# EAGLE design 3310 (EAGLE 7.1.0)
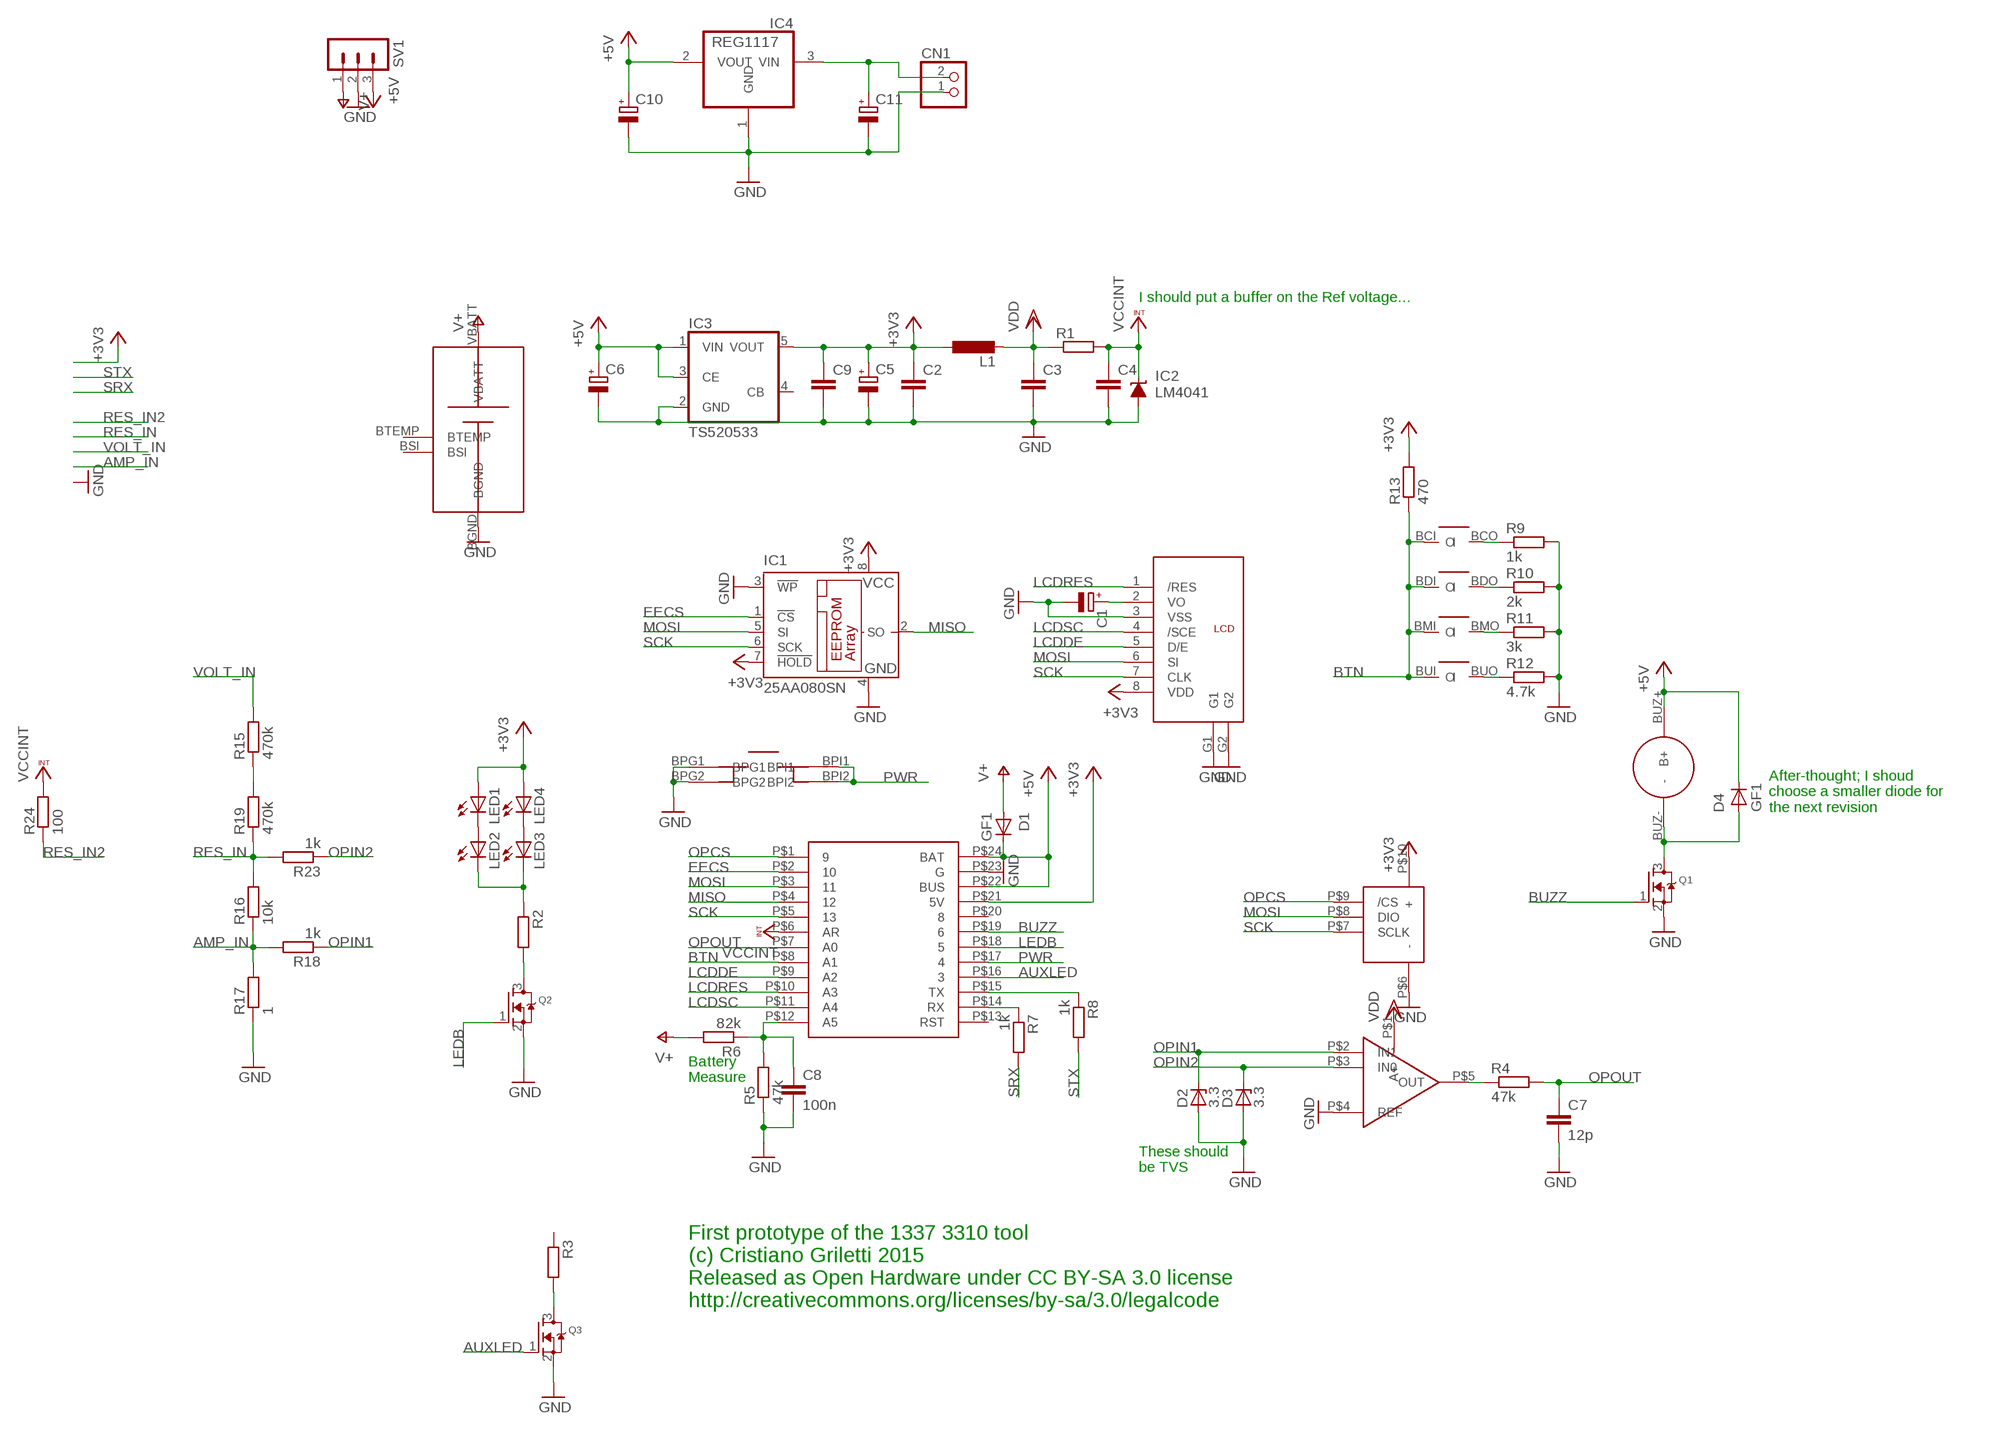
[diagram p0: schematic, sheet 1]

## Parts
C1  CPOL-EUC/6032-28R  [C/6032-28R]
C2  C-EUC0805K  [C0805K]
C3  C-EUC0805K  [C0805K]
C4  C-EUC0805K  [C0805K]
C5  CPOL-EUB/3528-21R  [B/3528-21R]
C6  CPOL-EUB/3528-21R  [B/3528-21R]
C7  12p  C-EUC0805K  [C0805K]
C8  100n  C-EUC0805K  [C0805K]
C9  C-EUC0805K  [C0805K]
C10  CPOL-EUB/3528-21R  [B/3528-21R]
C11  CPOL-EUB/3528-21R  [B/3528-21R]
CN1  JST_2PIN-SMT  [JST-PH-2-SMT]
D1  GF1  [SMA-DO214AC]
D2  3.3  ZENER-DIODESOD80C  [SOD80C]
D3  3.3  ZENER-DIODESOD80C  [SOD80C]
D4  GF1  [SMA-DO214AC]
IC1  25AA080SN  [SO-08]
IC2  LM4041  LM4041A12DBZ  [DBZ_R-PDSO-G3]
IC3  TS520533  [SOT25]
IC4  REG1117  [SOT223]
L1  L-EUL3216C  [L3216C]
LED1  LEDCHIPLED_0603  [CHIPLED_0603]
LED2  LEDCHIPLED_0603  [CHIPLED_0603]
LED3  LEDCHIPLED_0603  [CHIPLED_0603]
LED4  LEDCHIPLED_0603  [CHIPLED_0603]
Q1  MOSFET-NREFLOW  [SOT23]
Q2  MOSFET-NREFLOW  [SOT23]
Q3  MOSFET-NREFLOW  [SOT23]
R1  R-EU_R0805  [R0805]
R2  R-EU_R0805  [R0805]
R3  R-EU_R0805  [R0805]
R4  47k  R-EU_R0805  [R0805]
R5  47k  R-EU_R0805  [R0805]
R6  82k  R-EU_R0805  [R0805]
R7  1k  R-EU_R0805  [R0805]
R8  1k  R-EU_R0805  [R0805]
R9  1k  R-EU_R0805  [R0805]
R10  2k  R-EU_R0805  [R0805]
R11  3k  R-EU_R0805  [R0805]
R12  4.7k  R-EU_R0805  [R0805]
R13  470  R-EU_R0805  [R0805]
R15  470k  R-EU_R0805  [R0805]
R16  10k  R-EU_R0805  [R0805]
R17  1  R-EU_R0805  [R0805]
R18  1k  R-EU_R0805  [R0805]
R19  470k  R-EU_R0805  [R0805]
R23  1k  R-EU_R0805  [R0805]
R24  100  R-EU_R0805  [R0805]
SV1  MA03-1  [MA03-1]
U$1  3310PANEL_NONUM  [3310BRD_NONUM]
U$2  PGA113  [VSSOP]
U$3  TRINKET  [TRINKET]

## Nets
+3V3: C2.1 C5.+ C9.1 IC1.7(!HOLD) IC1.8(VCC) IC3.5(VOUT) L1.1 LED1.A LED4.A R13.2 U$1.8(VDD) U$2.P$10(+) U$3.P$21(5V)
+5V: C6.+ C10.+ D1.K(C) D4.K(C) IC3.1(VIN) IC3.3(CE) IC4.2(VOUT) SV1.3 U$1.BUZ+(B+) U$3.P$22(BUS) U$3.P$24(BAT)
AMP_IN: R16.1 R17.2 R18.2
AUXLED: Q3.1(G) U$3.P$16
BTN: R13.1 U$1.BCI(I) U$1.BDI(I) U$1.BMI(I) U$1.BUI(I) U$3.P$8(A1)
BUZZ: Q1.1(G) U$3.P$19
EECS: IC1.1(!CS) U$3.P$2
GND: C1.- C2.2 C3.2 C4.2 C5.- C6.- C7.2 C8.2 C9.2 C10.- C11.- CN1.1 D2.A D3.A IC1.3(!WP) IC1.4(GND) IC2.2(A) IC3.2(GND) IC4.1(GND) Q1.2(S) Q2.2(S) Q3.2(S) R5.1 R9.2 R10.2 R11.2 R12.2 R17.1 SV1.2 U$1.3(VSS) U$1.BGND U$1.BPG1 U$1.BPG2 U$1.G1 U$1.G2 U$2.P$4(REF) U$2.P$6(-) U$3.P$23(G)
LCDDE: U$1.5(D/E) U$3.P$9(A2)
LCDRES: U$1.1(/RES) U$3.P$10(A3)
LCDSC: U$1.4(/SCE) U$3.P$11(A4)
LEDB: Q2.1(G) U$3.P$18
MISO: IC1.2(SO) U$3.P$4
MOSI: IC1.5(SI) U$1.6(SI) U$2.P$8(DIO) U$3.P$3
N$1: C1.+ U$1.2(VO)
N$2: R4.1 U$2.P$5(OUT)
N$3: C8.1 R5.2 R6.1 U$3.P$12(A5)
N$4: D4.A Q1.3(D) U$1.BUZ-(-)
N$5: R8.1 U$3.P$15(TX)
N$6: R7.1 U$3.P$14(RX)
N$7: Q2.3(D) R2.2
N$8: R9.1 U$1.BCO(O)
N$9: R10.1 U$1.BDO(O)
N$10: R11.1 U$1.BMO(O)
N$11: R12.1 U$1.BUO(O)
N$12: R15.1 R19.2
N$13: LED1.C LED2.A
N$14: LED3.A LED4.C
N$17: LED2.C LED3.C R2.1
N$19: Q3.3(D) R3.2
N$21: C11.+ CN1.2 IC4.3(VIN)
OPCS: U$2.P$9(/CS) U$3.P$1
OPIN1: D2.C R18.1 U$2.P$2(IN1)
OPIN2: D3.C R23.1 U$2.P$3(IN0)
OPOUT: C7.1 R4.2 U$3.P$7(A0)
PWR: U$1.BPI1 U$1.BPI2 U$3.P$17
RES_IN: R16.2 R19.1 R23.2
RES_IN2: R24.1
SCK: IC1.6(SCK) U$1.7(CLK) U$2.P$7(SCLK) U$3.P$5
SRX: R7.2
STX: R8.2
V+: D1.A R6.2 SV1.1 U$1.VBATT
VCCINT: C4.1 IC2.1(C) R1.2 R24.2 U$3.P$6(AR)
VDD: C3.1 L1.2 R1.1 U$2.P$1(A+)
VOLT_IN: R15.2
Unconnected: IC3.4(CB) R3.1 U$1.BSI U$1.BTEMP U$3.P$13(RST) U$3.P$20

## Notes on the sheet
- I should put a buffer on the Ref voltage...
- After-thought; I shoud
  choose a smaller diode for
  the next revision
- Battery
  Measure
- These should
  be TVS
- First prototype of the 1337 3310 tool
  (c) Cristiano Griletti 2015
  Released as Open Hardware under CC BY-SA 3.0 license
  http://creativecommons.org/licenses/by-sa/3.0/legalcode

## Library data of the parts
C1 C5 C6 C10 C11 = rcl:CPOL-EU: POLARIZED CAPACITOR, European symbol
C2-C4 C7-C9 = rcl:C-EU: CAPACITOR, European symbol
CN1 = adafruit:JST_2PIN: JST 2-Pin Connectors of various flavors SMT-RA (S2B-PH-SM4) 4UConnector #17311 SMT (B2B-PH-SM4) THM-RA (S2B-PH) THM (B2B-PH)
D1 D4 = diode:GF1: DIODE
D2 D3 = diode:ZENER-DIODE: Z-Diode
IC1 = microchip:25*: Serial EEPROM 4K/ 8K , SPI bus; MF: MICROCHIP; MPN: 25AA080/SN; OC_FARNELL: 1816072; OC_NEWARK: 92C7351
IC2 = texas:LM4041: PRECISION MICROPOWER SHUNT VOLTAGE REFERENCE Source: http://focus.ti.com/lit/ds/slcs146e/slcs146e.pdf; MPN: LM4041A12IDBZR; OC_FARNELL: 1407949; OC_NEWARK: 58K5875
IC3 = v-reg:TS5205: 150mA Low Noise LDO Voltage Regulator with Enable TSC [Taiwan Semiconductor Company, Ltd] Source: http://www.taiwansemi.com .. 5205_0409c.pdf
IC4 = burr-brown:REG1117: 800mA and 1A Low Dropout (LDO) Positive Regulator 1.8V, 2.5V, 2.85V, 3.3V, 5V, and Adj; MPN: REG1117; OC_FARNELL: 1097566; OC_NEWARK: 14P6981
L1 = rcl:L-EU: INDUCTOR, European symbol
LED1-LED4 = adafruit:LED: LED OSRAM: - CHIPLED LG R971, LG N971, LY N971, LG Q971, LY Q971, LO R971, LY R971 LH N974, LH R974 LS Q976, LO Q976, LY Q976 LO Q996 - Hyper CHIPLED LW Q18S LB Q993, LB Q99A, LB R99A - SideLED LS A670, LO A670, LY A670, LG A670, LP A670 LB A673, LV A673, LT A673, LW A673 LH A674 LY A675 LS A676, LA A676, LO A676, LY A676, LW A676 LS A679, LY A679, LG A679 - Hyper Micro SIDELED® LS Y876, LA Y876, LO Y876, LY Y876 LT Y87S - SmartLED LW L88C, LW L88S LB L89C, LB L89S, LG L890 LS L89K, LO L89K, LY L89K LS L896, LA L896, LO L896, LY L896 - TOPLED LS T670, LO T670, LY T670, LG T670, LP T670 LSG T670, LSP T670, LSY T670, LOP T670, LYG T670 LG T671, LOG T671, LSG T671 LB T673, LV T673, LT T673, LW T673 LH T674 LS T676, LA T676, LO T676, LY T676, LB T676, LH T676, LSB T676, LW T676 LB T67C, LV T67C, LT T67C, LS T67K, LO T67K, LY T67K, LW E67C LS E67B, LA E67B, LO E67B, LY E67B, LB E67C, LV E67C, LT E67C LW T67C LS T679, LY T679, LG T679 LS T770, LO T770, LY T770, LG T770, LP T770 LB T773, LV T773, LT T773, LW T773 LH T774 LS E675, LA E675, LY E675, LS T675 LS T776, LA T776, LO T776, LY T776, LB T776 LHGB T686 LT T68C, LB T68C - Hyper Mini TOPLED® LB M676 - Mini TOPLED Santana® LG M470 LS M47K, LO M47K, LY M47K Source: http://www.osram.convergy.de/
Q1-Q3 = adafruit:MOSFET-N: N-Channel Mosfet 2N7002E - 60V 260mA SOT23 [Digikey: 2N7002ET1GOSTR-ND] - REEL BSH103 - 30V 850mA SOT23 [Digikey: 568-5013-1-ND]
R1-R13 R15-R19 R23 R24 = rcl:R-EU_: RESISTOR, European symbol
SV1 = con-lstb:MA03-1: PIN HEADER; OC_FARNELL: unknown; OC_NEWARK: unknown
U$1 = mastrogippo:3310PANEL_NONUM
U$2 = cris2:PGA113
U$3 = cris2:TRINKET

## Board
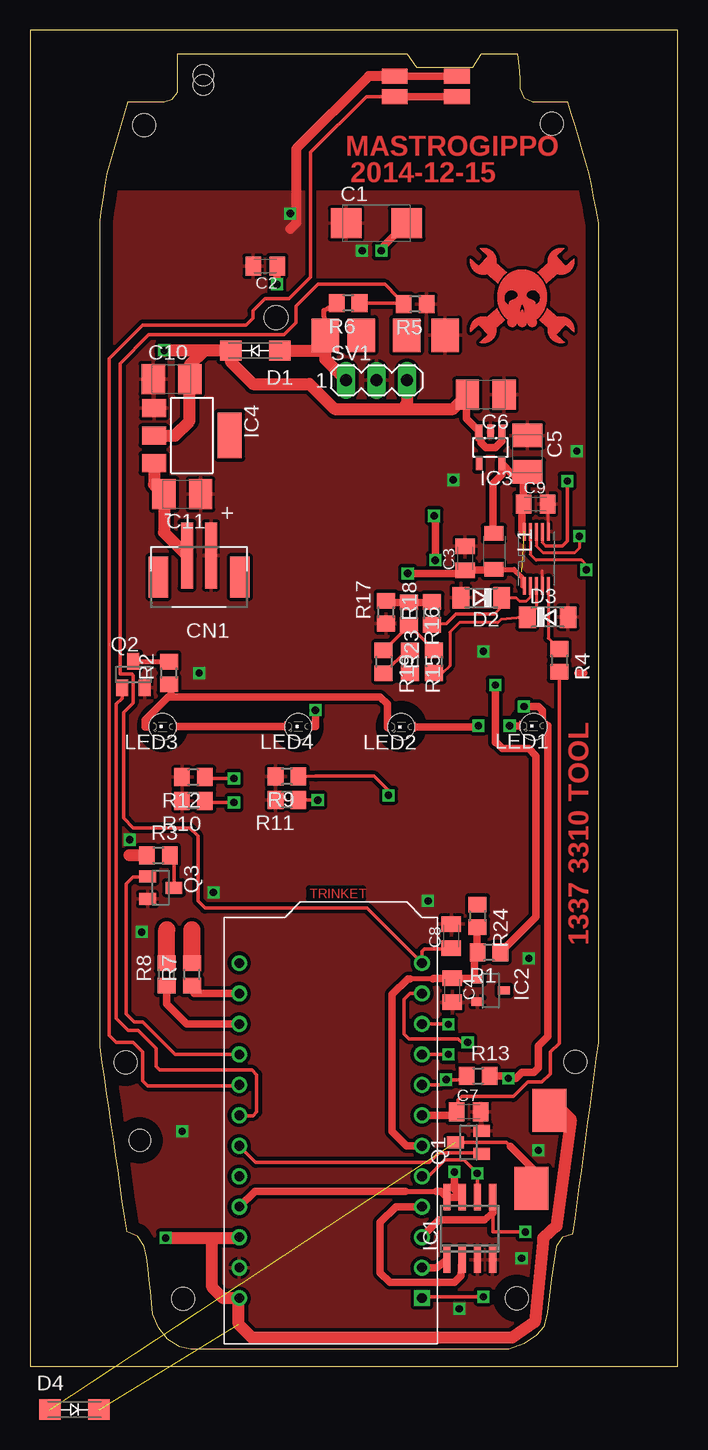
[diagram p1: board, top side]
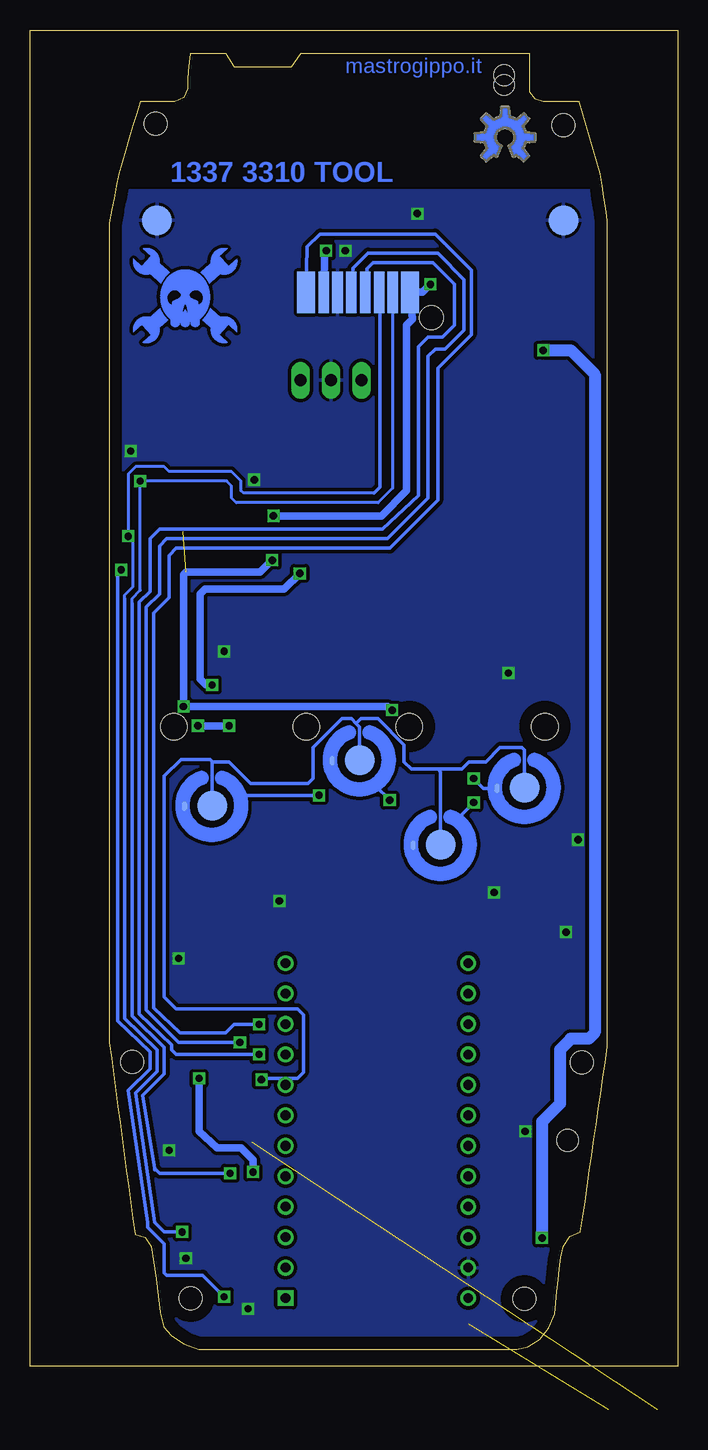
[diagram p2: board, bottom side, seen from below]

Size 54 x 111.4 mm. Coordinates in mm from the lower left corner, seen from the top.
Outline: 0,0 54,0 54,111.4 0,111.4 0,0
Copper layers (1*16): Top 0.035mm / dielectric 1.5mm / Bottom 0.035mm
Design rules "default": minimum track width 10mil, minimum drill 24mil, track to track 8mil, track to pad 8mil, pad to pad 8mil, via to via 8mil, smd to smd 8mil, copper to edge 40mil, drill to drill 8mil, minimum pad ring 10mil, minimum via ring 8mil, stop-mask expansion 4mil, vias tented up to drill 0mil, thermal gap 10mil

### Footprints (pad centres in the part's own frame; a part is rotated, then mirrored left to right if it is on the bottom)
C/6032-28R = smd 2.55 x 2.5: + 2.525,0; - -2.525,0
C0805K = smd 1.3 x 1.6: 1 -1,0; 2 1,0
B/3528-21R = smd 1.95 x 2.5: + 1.525,0; - -1.525,0
JST-PH-2-SMT = smd 1 x 5.5: 1 -1,-1.8; 2 1,-1.8 | smd 1.6 x 3.4: NC1 -3.4,0; NC2 3.4,0
SMA-DO214AC = smd 1.8 x 1.7: A -2.05,0; K 2.05,0
SOD80C = smd 1.4 x 1.8: A 1.7,0; C -1.7,0
SO-08 = smd 0.6 x 2.2: 1 -1.905,-2.6; 2 -0.635,-2.6; 3 0.635,-2.6; 4 1.905,-2.6; 5 1.905,2.6; 6 0.635,2.6; 7 -0.635,2.6; 8 -1.905,2.6
DBZ_R-PDSO-G3 = smd 0.7 x 1: 1 -0.95,-1.1; 2 0.95,-1.1; 3 0,1.1
SOT25 = smd 0.55 x 1.2: 1 -0.95,-1.3; 2 0,-1.3; 3 0.95,-1.3; 4 0.95,1.3; 5 -0.95,1.3
SOT223 = smd 1.499 x 2.007: 1 -2.261,-3.15; 2 0.025,-3.15; 3 2.311,-3.15 | smd 3.81 x 2.007: 4 0,3.15
L3216C = smd 1.2 x 1.6: 1 -1.5,0; 2 1.5,0
CHIPLED_0603 = smd 0.8 x 0.8: A 0,-0.75; C 0,0.75
SOT23 = smd 1 x 1.4: 1 -0.95,-1.1; 2 0.95,-1.1; 3 0,1.1
R0805 = smd 1.3 x 1.5: 1 -0.95,0; 2 0.95,0
MA03-1 = drill 1.016 long: 1 -2.54,0; 2 0,0; 3 2.54,0
3310BRD_NONUM = smd 1.5 x 3.429: 1 -5.166,19.08; 8 3.512,19.08 | smd 0.889 x 3.429: 2 -3.698,19.08; 3 -2.55,19.08; 4 -1.401,19.08; 5 -0.243,19.08; 6 0.926,19.08; 7 2.054,19.08 | smd 2.5 x 2.5: BCI -13,-23.72; BDI 6.05,-26.97; BMI -0.7,-19.92; BUI 13.05,-22.22; G1 -17.6,25.08; G2 16.3,25.08 | smd 0.406 x 0.813: BCO -15.3,-23.77; BDO 3.75,-27.02; BMO -3,-19.97; BUO 10.75,-22.27 | smd 2.3 x 2.8 bottom: BGND -8.8,15.5; BSI -1.8,15.5; BTEMP -5.6,15.5; VBATT 1.2,15.5 | smd 2.15 x 1.25 bottom: BPG1 -9.8,37.1; BPG2 -4.6,37.1; BPI1 -9.8,35.4; BPI2 -4.6,35.4 | smd 2.8 x 3.6 bottom: BUZ+ -17.5,-49.1; BUZ- -16,-55.6 | hole 1.905: 16.295,33.029; -17.705,33.129; 13.045,-64.821; -14.805,-64.771; -19.655,-45.071; 17.845,-45.121 | hole 2: 5.3,16.98 | hole 1.7: 11.35,37.18; 11.35,36.38 | hole 2.2: -16.2,-17.12; -5.15,-17.12; 3.45,-17.12; 14.75,-17.12 | hole 1.8: 16.65,-51.62
VSSOP = smd 1.45 x 0.26: P$1 -2,1; P$2 -2,0.5; P$3 -2,0; P$4 -2,-0.5; P$5 -2,-1; P$6 2.5,-1; P$7 2.5,-0.5; P$8 2.5,0; P$9 2.5,0.5; P$10 2.5,1
TRINKET = drill 0.8 square: P$1 -5.08,6.35 | drill 0.8: P$2 -5.08,3.81; P$3 -5.08,1.27; P$4 -5.08,-1.27; P$5 -5.08,-3.81; P$6 -5.08,-6.35; P$7 -5.08,-8.89; P$8 -5.08,-11.43; P$9 -5.08,-13.97; P$10 -5.08,-16.51; P$11 -5.08,-19.05; P$12 -5.08,-21.59; P$13 10.16,-21.59; P$14 10.16,-19.05; P$15 10.16,-16.51; P$16 10.16,-13.97; P$17 10.16,-11.43; P$18 10.16,-8.89; P$19 10.16,-6.35; P$20 10.16,-3.81; P$21 10.16,-1.27; P$22 10.16,1.27; P$23 10.16,3.81; P$24 10.16,6.35

### Placement (x,y rotation side)
C1  28.89,95.29 0 top
C2  19.62,91.71 180 top
C3  36.29,67.36 90 top
C4  35.21,31.35 270 top
C5  41.49,76.08 270 top
C6  38,81 180 top
C7  36.58,21.22 0 top
C8  35.13,35.87 90 top
C9  42.15,71.88 0 top
C10  11.8,82.3 0 top
C11  12.7,72.7 180 top
CN1  14.1,65.8 180 top
D1  18.79,84.67 180 top
D2  37.63,64.07 180 top
D3  43.17,62.45 0 top
D4  3.7,-3.6 0 top  (outside the outline)
IC1  36.67,11.5 0 top
IC2  38.43,31.34 270 top
IC3  38.4,76.6 180 top
IC4  13.5,77.6 270 top
L1  38.69,67.93 270 top
LED1  41.98,53.39 90 top
LED2  30.98,53.31 90 top
LED3  11.08,53.33 90 top
LED4  22.38,53.35 90 top
Q1  36.57,18.67 90 top
Q2  8.62,57.67 0 top
Q3  10.9,39.9 270 top
R1  38.28,34.51 180 top
R2  11.6,57.8 90 top
R3  10.7,42.6 0 top
R4  44.14,58.85 270 top
R5  32.13,88.54 180 top
R6  26.53,88.62 180 top
R7  13.51,32.67 90 top
R8  11.39,32.67 90 top
R9  21.43,49.17 180 top
R10  13.63,47.15 180 top
R11  21.43,47.23 180 top
R12  13.63,49.11 180 top
R13  37.37,24.21 0 top
R15  31.67,58.73 270 top
R16  31.59,62.73 270 top
R17  29.69,62.87 90 top
R18  33.53,62.77 90 top
R19  29.49,58.73 270 top
R23  33.7,58.75 90 top
R24  37.32,37.55 270 top
SV1  28.9,82.2 0 top
U$1  25.81,70.45 0 bottom
U$2  42.22,67.07 90 top
U$3  27.61,12.03 180 top

### Tracks (layer width: path | path; a pad name or v marks a point on that pad's centre or on a via)
+3V3  (via drill 0.6)  (1 unrouted)
  Top 0.254: U$2.P$10 41.03,69.57
  Top 0.305: 41.03,69.57 41,69.6
  Top 0.406: 31.3,14.6 33.9,14.6
  Top 0.61: L1.1 38.6,69.52 38.6,73.6 39.35,74.35 IC3.5 39.35,75.25 40.2,74.4 41.34,74.4 C5.+ 41.15,74.56 C9.1 41,71.53 41,69.6 | v20.6,90.2 20.6,90.73 C2.1 | LED1.A 42.73,54.67 42.4,55 v41.2,55 | v23.8,54.7 23.8,53.32 LED4.A | 31.3,14.6 18.75,14.6 U$3.P$21 | 42.6,53.26 LED1.A | v33.8,67.2 33.8,70.8 v33.7,70.9 | LED1.A 43.2,53.42 43.2,27.5 42.4,26.7 42.4,24.9 42,24.5 41,24.5 40.5,24 v39.9,24 39.69,24.21 R13.2 | 33.9,14.6 34.27,14.6 IC1.8 IC1.7 35.4,14.74 v35.4,16.2
  Bottom 0.61: v20.6,90.2 21.27,89.53 U$1.8 22.1,87.3 22.6,86.8 22.6,73 24.7,70.9 v33.7,70.9 | v23.8,54.7 24.2,55 v41.2,55 41.2,66 41,66.2 34.8,66.2 v33.8,67.2 | v39.9,24 39.9,19.6 38.4,18.2 36.4,18.2 35.4,17.2 v35.4,16.2
+5V  (via drill 0.6)  (1 unrouted)
  Top 0.61: IC3.1 39.35,77.15 38.8,76.6 38,76.6 37.6,77 37.6,77.2 37.4,77.4 37.4,77.85 IC3.3 37.45,77.95 36.4,79 36.4,80.93 C6.+
  Top 1.016: 14.5,84.67 D1.K 16.74,83.76 18.6,81.9 23.3,81.9 25.4,79.8 31,79.8 | 14.5,84.67 11.2,84.67 v11.2,84.7 | v11.3,10.7 15.2,10.7 | 15.2,10.7 17.01,10.7 U$3.P$22 | 15.2,10.7 15.2,6.6 16.12,5.68 U$3.P$24 17.4,5.63 17.4,3.5 18.5,2.4 40.2,2.4 42.1,3.7 42.8,10.7 43.9,11.7 45.1,20.6 44.35,21.35 U$1.BUZ+ | IC4.2 12.07,77.58 13.3,78.8 13.3,82.28 C10.+ 13.32,83.5 14.5,84.67 | 31,79.8 35.27,79.8 C6.+ | SV1.3 31.44,80.24 31,79.8
  Bottom 1.016: v11.2,84.7 8.9,84.7 6.9,82.7 6.9,27.8 7.4,27.3 8.9,27.3 9.8,26.4 9.8,21.9 11.3,20.4 v11.3,10.7
AMP_IN
  Top 0.61: R18.2 33.39,63.68 R16.1 29.61,63.68 R17.2
AUXLED
  Top 0.305: U$3.P$16 12.1,26 9.4,28.7 8.7,28.7 8,29.4 8,40.2 8.6,40.8 9.75,40.8 Q3.1
BTN  (via drill 0.6)
  Top 0.305: U$3.P$8 34.26,23.46 v34.7,23.9 36.11,23.9 R13.1
  Bottom 0.305: U$1.BCI 38.81,50.41 | 38.81,50.41 39,50.6 41.4,50.6 42.8,49.2 42.8,30.8 41.8,29.8 31.7,29.8 31.2,29.3 31.2,24.5 31.7,24 34.6,24 v34.7,23.9 | U$1.BMI 26.51,53.31 26.8,53.6 | 26.8,53.6 27.2,54 28,54 30.4,51.6 30.4,49 30.8,48.6 35.6,48.6 37.4,50.4 38.8,50.4 38.81,50.41 | U$1.BUI 12.76,51.36 13,51.6 14.8,51.6 16,50.4 17.4,50.4 18,49.8 20,49.8 | 20,49.8 22.2,49.8 22.8,50.4 22.8,51.8 25,54 26.4,54 26.8,53.6 | U$1.BDI 19.76,49.56 20,49.8
BUZZ
  Top 0.305: U$3.P$19 18.83,17 33.3,17 34.1,17.8 37.59,17.8 Q1.1
EECS
  Top 0.61: U$3.P$2 33.88,8.22 IC1.1
GND  (via drill 0.6)
  Top 0.254: U$2.P$4 42.72,66.28 42.7,66.3 | U$2.P$6 43.22,71.81 C9.2
  Top 0.61: U$1.BPG1 U$1.BPG2
  Top 0.813: U$1.BPG2 28.25,107.55 22.2,101.5 22.2,95.3 21.7,94.8
  other vias: 14.1,57.8 15.3,39.5 9.3,36.2 42.4,18 12.7,19.6 41,9 35.8,4.8 41.6,34 33.2,38.8 37.8,59.6 27.7,93 45.6,76.3 21.7,96.1 35.3,73.9 8.3,43.9
  pour Top (isolate 0.3): 5.8,97.9 47.5,97.9 47.5,0.2 5.8,0.2
  pour Bottom (isolate 0.3): 5.7,98 47.6,98 47.5,0.2 5.7,-0.1
LCDDE  (via drill 0.6)
  Top 0.305: v34.9,26 U$3.P$9
  Bottom 0.305: U$1.5 25.9,91.5 25.4,92 20.4,92 18.6,90.2 18.6,86.8 19.6,85.8 20.8,85.8 21.6,85 21.6,72.6 24.6,69.8 43.2,69.8 44,69 44,64.6 44.9,63.7 44.9,29.4 42.2,26.8 42.2,26.4 41.8,26 v34.9,26
LCDRES  (via drill 0.6)
  Top 0.305: U$3.P$10 34.86,28.54 v34.9,28.5
  Bottom 0.305: U$1.1 30.88,93.32 29.8,94.4 20.2,94.4 17.2,91.4 17.2,86 20,83.2 20,72.2 24,68.2 41.8,68.2 42.4,67.6 42.4,64.1 43.7,62.8 43.7,29.9 41.5,27.8 37.7,27.8 37,28.5 v34.9,28.5
LCDSC  (via drill 0.6)
  Top 0.305: v36.5,27 36,27 35.7,27.3 31.6,27.3 31.2,27.7 31.2,30.6 31.7,31.1 32.67,31.1 U$3.P$11
  Bottom 0.305: U$1.4 27.07,91.53 25.8,92.8 20,92.8 17.8,90.6 17.8,86.4 19.4,84.8 20.2,84.8 20.8,84.2 20.8,72.4 24.2,69 42.6,69 43.2,68.4 43.2,64.4 44.3,63.3 44.3,29.7 41.6,27 v36.5,27
LEDB
  Top 0.305: Q2.1 7.67,55.67 7.2,55.2 7.2,29 8.2,28 9,28 10.5,26.5 10.5,25 10.8,24.7 18.5,24.7 18.9,24.3 18.9,21.2 18.6,20.9 17.47,20.9 U$3.P$18
MISO
  Top 0.61: U$3.P$4 30.5,13.3 29.2,12 29.2,7.8 30,7 35.4,7 35.94,7.54 IC1.2
MOSI  (via drill 0.6)
  Top 0.254: U$2.P$8 42.22,68.38 42.8,67.8 45.4,67.8 45.8,68.2 v45.8,69.2
  Top 0.305: v41.3,11.2 38.6,11.2 38.6,12.8
  Top 0.61: U$3.P$3 32.66,10.76 34.1,12.2 37.9,12.2 38.6,12.8 38.6,14.03 IC1.5
  Bottom 0.254: U$1.6 24.73,89.27 24.8,89.2 | 46.1,64 46.1,64.3 45.4,65 45.4,68.8 v45.8,69.2 45.8,74.4 45.2,75 42.8,75 42.4,74.6 37.2,74.6 36.4,73.8 36.4,73 36.2,72.8 25.3,72.8
  Bottom 0.305: 46.1,64 46.1,29 43.4,26.4 43.4,24.6 45.2,22.8 43.6,12 42.8,11.2 v41.3,11.2 | 24.8,89.2 24.8,73.3 25.3,72.8
N$1  (via drill 0.6)
  Top 0.61: v29.3,93 29.33,93.2 C1.+
  Bottom 0.61: U$1.2 29.41,93.19 v29.3,93
N$2
  Top 0.254: U$2.P$5 43.22,60.69 R4.1
N$3
  Top 0.305: R6.1 30.63,88.62 R5.2 30.71,89.09 29.6,90.2 24,90.2 22.2,88.4 22.2,87 21.2,86 9.9,86 7.5,83.6 7.5,57.7 8.5,57.7 8.6,57.6 8.6,55.3 7.8,54.5 7.8,45.7 8.6,44.9 13.3,44.9 14,44.2 14,38.8 14.6,38.2 28.11,38.2 U$3.P$12 32.69,34.59 32.9,34.8 35.06,34.8 C8.1
N$4  (1 unrouted)
  Top 0.305: Q1.3 39.73,18.67 40.07,18.33
  Top 0.61: 40.07,18.33 42,16.4 42,14.66 U$1.BUZ-
N$5
  Top 0.61: U$3.P$15 13.06,28.54 11.4,30.2 11.4,31.44 R8.1
N$6
  Top 0.61: U$3.P$14 13.68,31.08 R7.1
N$7
  Top 0.406: Q2.3 11.32,58.77 R2.2
N$8  (via drill 0.6)
  Top 0.305: v29.9,47.6 29.9,48 28.7,49.2 23.82,49.2 R9.1
  Bottom 0.305: U$1.BCO 41.11,45.71 40,44.6 37.6,44.6 36.8,45.4 36.8,47.4 36.6,47.6 v29.9,47.6
N$9  (via drill 0.6)
  Top 0.305: v17,47 14.5,47 R10.1
  Bottom 0.305: U$1.BDO 22.06,42.06 21.4,41.4 18.8,41.4 18,42.2 18,42.6 17.4,43.2 17.4,45 18,45.6 18,46 v17,47
N$10  (via drill 0.6)
  Top 0.305: v24,47.2 23.88,47.2 R11.1
  Bottom 0.305: U$1.BMO 28.81,49.61 27.6,48.4 25.2,48.4 v24,47.2
N$11  (via drill 0.6)
  Top 0.305: v17,49 14.66,49 R12.1
  Bottom 0.305: U$1.BUO 16.18,48.18 v17,49
N$12
  Top 0.305: 31.57,59.78 31.57,59.76 R19.2
  Top 0.61: 31.57,59.78 R15.1
N$13  (via drill 0.6)
  Top 0.61: LED2.A 37.31,53.31 v37.4,53.4 | v40,53.4 LED1.C
  Bottom 0.61: v37.4,53.4 v40,53.4
N$14
  Top 0.61: LED3.A 21.31,53.33 LED4.C
N$15
  Top 1.422: 13.5,34.2 13.5,36.4
N$16
  Top 1.422: 11.4,34.1 11.4,36.4
N$17
  Top 0.406: R2.1 11.6,56.3 12.1,55.8
  Top 0.61: LED2.C 29.8,53.24 29.8,55.2 29.2,55.8 12.1,55.8 11.5,55.8 9.6,53.9 9.6,53.3 10.3,53.3 LED3.C
N$18
  Top 0.61: 46.2,57.8 45.7,57.8
N$19
  Top 0.305: Q3.3 12,42.35 R3.2
N$20
  Top 1.016: 9.7,42.6 8.3,42.6
N$21
  Top 1.016: IC4.3 10.35,73.53 C11.+ 11.18,69.53 CN1.2
OPCS  (via drill 0.6)
  Top 0.254: U$2.P$9 41.72,67.68 42.2,67.2 46,67.2 46.4,66.8 v46.4,66.4
  Top 0.305: v37.8,5.8 32.71,5.8 U$3.P$1
  Bottom 0.254: 46.7,66.1 v46.4,66.4
  Bottom 0.305: 46.7,66.1 46.7,28.8 44,26.2 44,24.8 45.8,23 44.2,12 44.2,11.6 42.8,10.2 42.8,7.8 42.6,7.6 39.6,7.6 v37.8,5.8
OPIN1
  Top 0.254: 38.72,62.72 39.4,63.4 39.4,63.9 D2.C 40.53,64.07 40.8,63.8 41.4,63.8 41.72,64.12 U$2.P$2
  Top 0.305: R18.1 34.72,61.92 35.5,62.7 38.7,62.7 38.72,62.72
OPIN2
  Top 0.254: U$2.P$3 42.22,63.22 41.25,62.25 D3.C 39.25,62.25 39,62 35.8,62 35,61.2 35,58.4 34.4,57.8 R23.1
OPOUT
  Top 0.305: R4.2 44.14,26.94 43.4,26.2 43.4,24.4 42.7,23.7 41.5,23.7 40.3,22.5 36,22.5 35.7,22.2 35.7,21.34 C7.1
  Top 0.61: U$3.P$7 35.12,20.92 35.6,21.4 35.66,21.2 C7.1
PWR
  Top 0.305: U$1.BPI2 28.05,105.85 23.4,101.2 23.4,90.8 21.6,89 19.6,89 18.6,88 18.6,87.4 18,86.8 9.4,86.8 6.6,84 6.6,27.6 7.2,27 8.6,27 9.4,26.2 9.4,23.8 9.8,23.4 17.09,23.4 U$3.P$17
  Top 0.61: U$1.BPI2 U$1.BPI1
RES_IN
  Top 0.305: R16.2 31.62,61.78 R23.2 | 31.49,61.68 31.49,61.58 R19.1
  Top 0.61: 31.49,61.68 R16.2 | R23.2 33.7,59.67
SCK  (via drill 0.6)
  Top 0.254: U$2.P$7 42.72,68.68 43,68.4
  Top 0.305: 43,68.4 44.4,68.4 44.8,68.8 v44.8,73.8 | IC1.6 v37.3,16.09 v37.3,16.1 36.2,17.2 34.6,17.2 33.19,15.79 U$3.P$5
  Top 0.61: 37.3,13.41 IC1.6
  Bottom 0.254: U$1.7 23.77,73.2 24.97,72 36.8,72 37.2,72.4 37.2,73.4 37.6,73.8 v44.8,73.8 44.8,64.7 45.5,64 45.5,63.6
  Bottom 0.305: 45.5,63.6 45.5,29.2 42.8,26.6 42.8,24.4 44.6,22.6 43.62,16.52 | 43.62,16.52 43.6,16.4 | v37.3,16.1 43.2,16.1 43.62,16.52
V+
  Top 0.406: U$1.VBATT 24.51,88.02 R6.2
  Top 1.016: D1.A 24.61,84.67 | 24.61,84.67 U$1.VBATT | 24.61,84.67 24.61,83.95 SV1.1
VCCINT
  Top 0.406: 33.6,32.3 31.7,32.3
  Top 0.61: 37.07,32.35 C4.1 33.65,32.35 33.6,32.3 | 37.07,32.35 IC2.1 | 37.07,32.35 37.07,34.35 R1.2 37.23,36.59 R24.2 | 31.7,32.3 31.5,32.3 30.2,31 30.2,19.6 31.4,18.4 32.67,18.4 U$3.P$6
VDD  (via drill 0.6)
  Top 0.254: U$2.P$1 41.07,65.07
  Top 0.305: 41.07,65.07 41,65 41,65.8
  Top 0.406: L1.2 40.37,66.43 41,65.8
  Top 0.61: 36.8,66.36 C3.1 36.53,66.1 v31.5,66.1 | 36.8,66.36 38.62,66.36 L1.2 | v38.8,56.8 38.8,52 38.9,52 39.4,51.5 41.6,51.5 42.2,50.9 42.2,37.48 R1.1 | 36.76,66.4 36.8,66.36
  Bottom 0.61: v38.8,56.8 39.3,56.8 39.8,57.3 39.8,64.4 39.4,64.8 32.8,64.8 v31.5,66.1
(copper drawn outside any net)
  shapes: Bottom area x2352, Top area x2352

### Text on the board
Top: MASTROGIPPO | 2014-12-15 | 1337 3310 TOOL | TRINKET
Bottom: 1337 3310 TOOL
Document: First prototype of the 1337 3310 tool / (c) Cristiano Griletti 2015 / Released as Open Hardware under CC BY-SA 3.0 license / http://creativecommons.org/licenses/by-sa/3.0/legalcode